# EAGLE design P2PlugTestUSB (EAGLE 9.6.2)
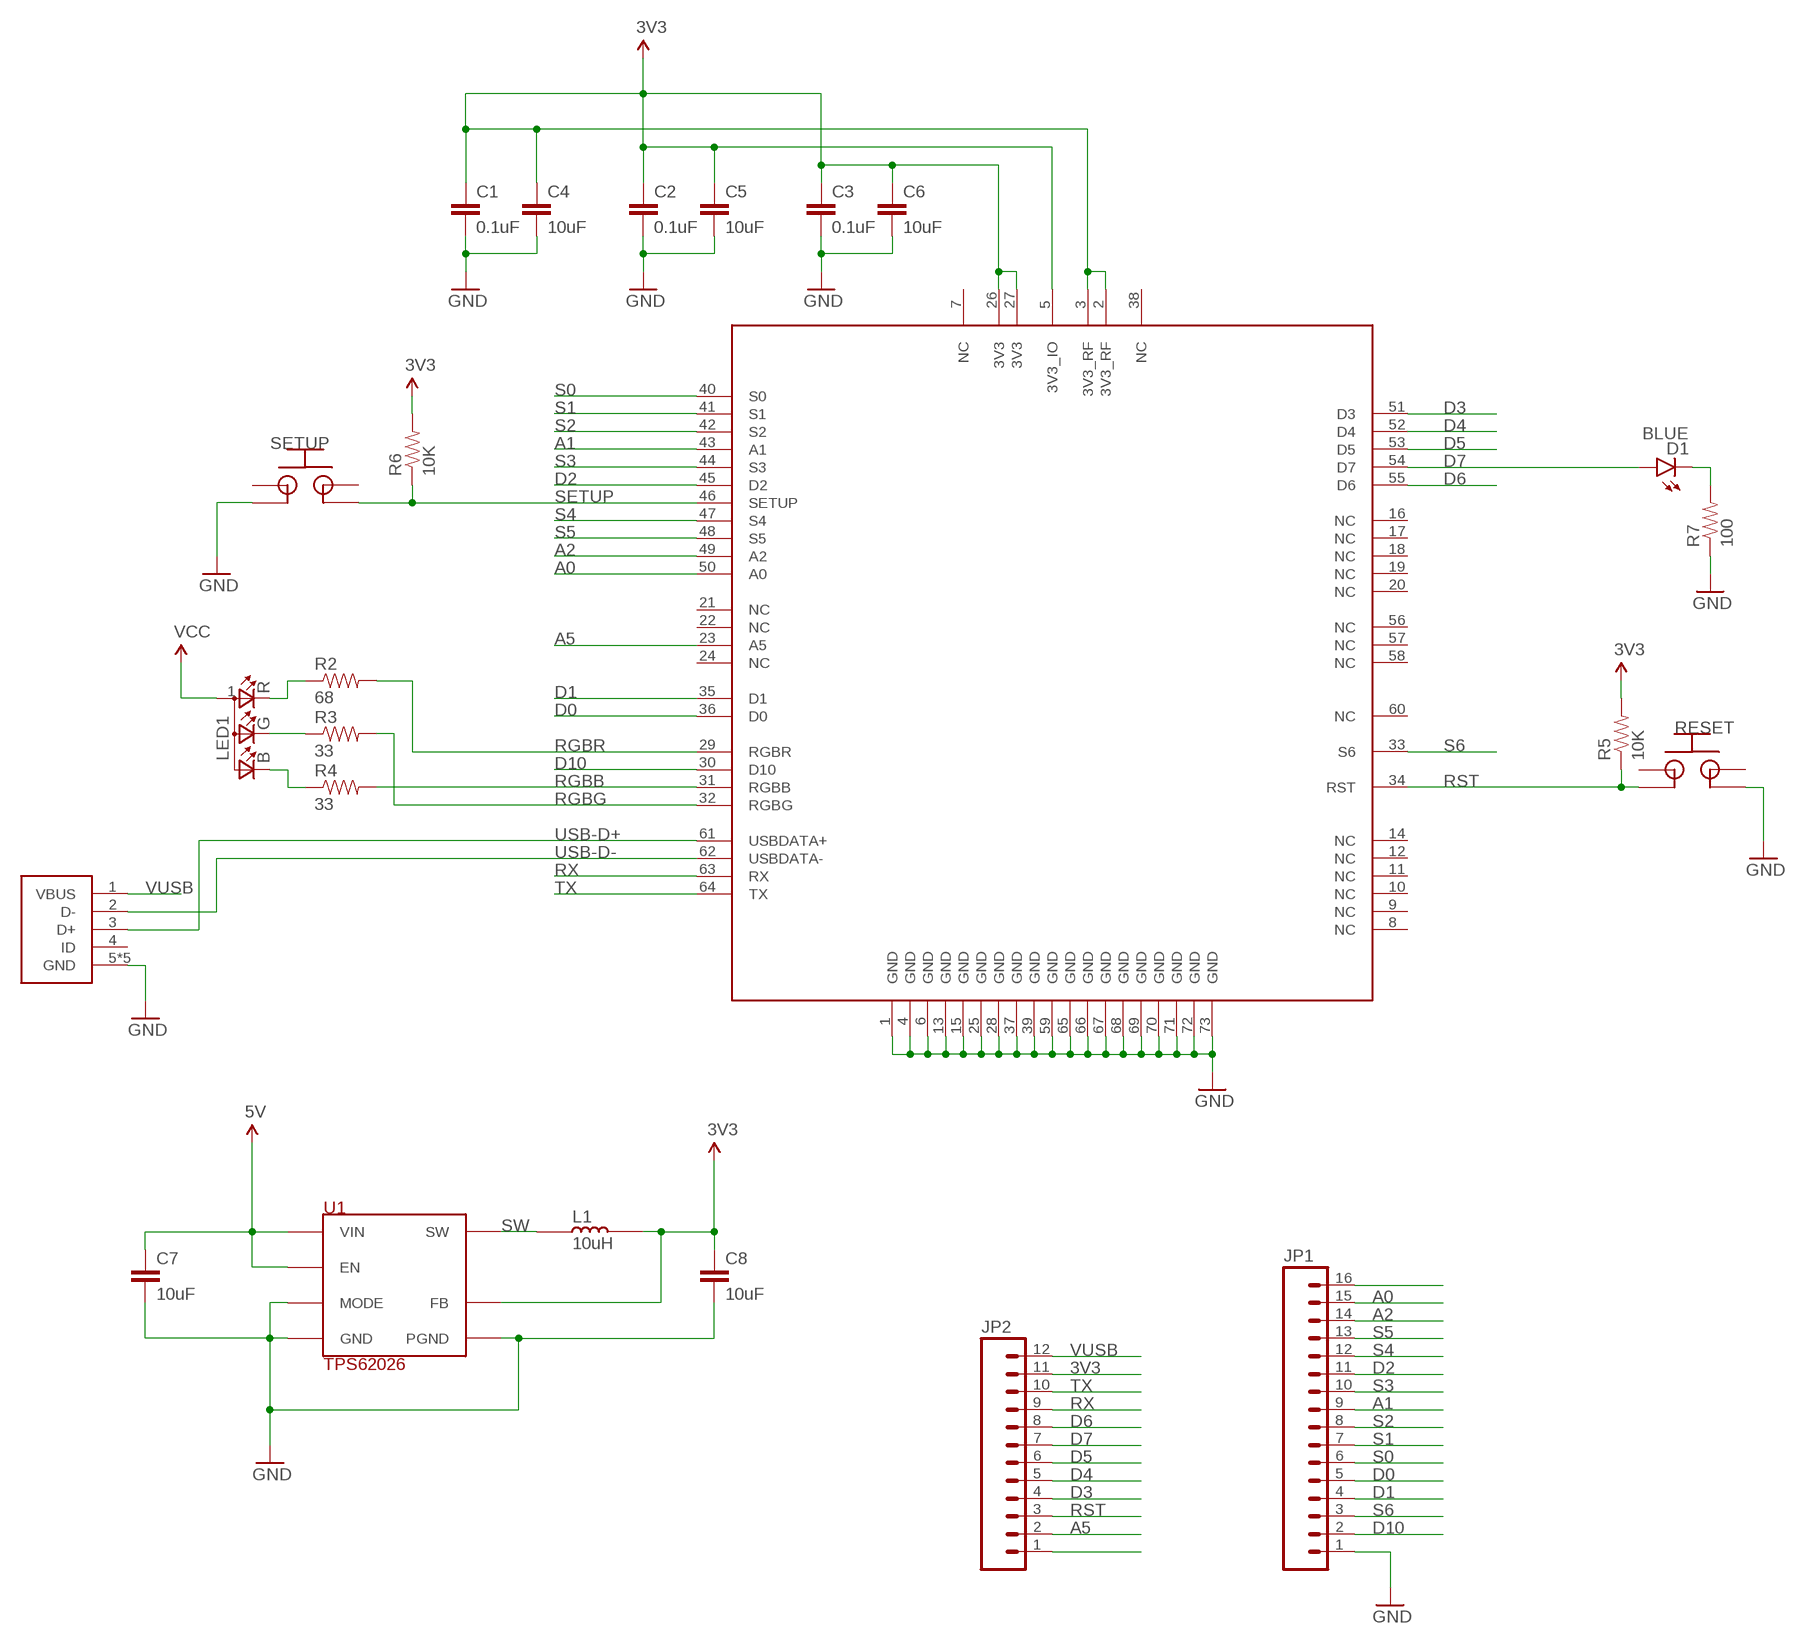
[diagram p0: schematic, sheet 1]

## Parts
C1  0.1uF  CAP-0.1UF-0603  [0603-CAP]
C2  0.1uF  CAP-0.1UF-0603  [0603-CAP]
C3  0.1uF  CAP-0.1UF-0603  [0603-CAP]
C4  10uF  CAP-10UF-0603  [0603-CAP]
C5  10uF  CAP-10UF-0603  [0603-CAP]
C6  10uF  CAP-10UF-0603  [0603-CAP]
C7  10uF  CAP-10UF-0603  [0603-CAP]
C8  10uF  CAP-10UF-0603  [0603-CAP]
D1  BLUE  LED-BLUE0603  [LED-0603]
JP1  M16PTH  [1X16]
JP2  M12PTH  [1X12]
L1  10uH  INDUCTOR-10UH  [BOURNS-INDUCTOR-3X3]
LED1  LED-RGB-CREE-SMD  [LED-RGB-CREE-SMD]
R2  68  RES-68-0603.DEV  [0603-RES]
R3  33  RES-33-0603.DEV  [0603-RES]
R4  33  RES-33-0603.DEV  [0603-RES]
R5  10K  RES-10K-06030603  [0603-RES]
R6  10K  RES-10K-06030603  [0603-RES]
R7  100  RES-100-0603.DEV  [0603-RES]
U1  TPS62026  TPS62026-REG-3.3V  [10-HVSSOP-TI]
U$1  USB-MICRO-B-SOCKET-AMPHENOL  [USB-B-SMT-AMPHENOL]
U$3  P2  [P2]
U$4  SWITCH-PTS645  [SWITCH-PTS645]
U$5  SWITCH-PTS645  [SWITCH-PTS645]

## Nets
3V3: C1.1 C2.1 C3.1 C4.1 C5.1 C6.1 C8.1 JP2.11 L1.2 LED1.1(A) R5.2 R6.2 U1.5(FB) U$3.2(3V3_RF) U$3.3(3V3_RF) U$3.5(3V3_IO) U$3.26(3V3) U$3.27(3V3) ; supply symbol labelled VCC
A0: JP1.15 U$3.50(A0)
A1: JP1.9 U$3.43(A1)
A2: JP1.14 U$3.49(A2)
A5: JP2.2 U$3.23(A5)
D0: JP1.5 U$3.36(D0)
D1: JP1.4 U$3.35(D1)
D2: JP1.11 U$3.45(D2)
D3: JP2.4 U$3.51(D3)
D4: JP2.5 U$3.52(D4)
D5: JP2.6 U$3.53(D5)
D6: JP2.8 U$3.55(D6)
D7: D1.A JP2.7 U$3.54(D7)
D10: JP1.2 U$3.30(D10)
GND: C1.2 C2.2 C3.2 C4.2 C5.2 C6.2 C7.2 C8.2 JP1.1 R7.1 U1.4(GND) U1.6(MODE) U1.9(PGND) U1.10(PGND) U1.P(GND) U$1.5(GND) U$1.P$1(GND) U$1.P$2(GND) U$1.P$6(GND) U$1.P$7(GND) U$3.1(GND) U$3.4(GND) U$3.6(GND) U$3.13(GND) U$3.15(GND) U$3.25(GND) U$3.28(GND) U$3.37(GND) U$3.39(GND) U$3.59(GND) U$3.65(GND) U$3.66(GND) U$3.67(GND) U$3.68(GND) U$3.69(GND) U$3.70(GND) U$3.71(GND) U$3.72(GND) U$3.73(GND) U$4.2 U$5.4
N$1: JP2.1
N$2: JP1.16
N$3: D1.C R7.2
N$5: LED1.4(R) R2.1
N$6: LED1.3(G) R3.1
N$7: LED1.2(B) R4.1
RGBB: R4.2 U$3.31(RGBB)
RGBG: R3.2 U$3.32(RGBG)
RGBR: R2.2 U$3.29(RGBR)
RST: JP2.3 R5.1 U$3.34(RST) U$5.2
RX: JP2.9 U$3.63(RX)
S0: JP1.6 U$3.40(S0)
S1: JP1.7 U$3.41(S1)
S2: JP1.8 U$3.42(S2)
S3: JP1.10 U$3.44(S3)
S4: JP1.12 U$3.47(S4)
S5: JP1.13 U$3.48(S5)
S6: JP1.3 U$3.33(S6)
SETUP: R6.1 U$3.46(SETUP) U$4.4
SW: L1.1 U1.7(SW) U1.8(SW)
TX: JP2.10 U$3.64(TX)
USB-D+: U$1.3(D+) U$3.61(USBDATA+)
USB-D-: U$1.2(D-) U$3.62(USBDATA-)
VUSB: C7.1 JP2.12 U1.1(EN) U1.2(VIN) U1.3(VIN) U$1.1(VBUS) ; supply symbol labelled 5V
Unconnected: U$1.4(ID) U$3.7(NC) U$3.8(NC) U$3.9(NC) U$3.10(NC) U$3.11(NC) U$3.12(NC) U$3.14(NC) U$3.16(NC) U$3.17(NC) U$3.18(NC) U$3.19(NC) U$3.20(NC) U$3.21(NC) U$3.22(NC) U$3.24(NC) U$3.38(NC) U$3.56(NC) U$3.57(NC) U$3.58(NC) U$3.60(NC) U$4.1 U$4.3 U$5.1 U$5.3

## Notes on the sheet
- SETUP
- RESET

## Library data of the parts
C1-C3 = rickk2:CAP-0.1UF-0603: CAP CER 0.1UF 16V X7R 0603 https://www.digikey.com/product-detail/en/murata-electronics-north-america/GRM188R71C104KA01D/490-1532-1-ND/587771
C4-C8 = rickk2:CAP-10UF-0603: CAP CER 10UF 16V X5R 0805 $ 0.21 https://www.digikey.com/product-detail/en/murata-electronics-north-america/GRM21BR61C106KE15L/490-3886-1-ND/965928
D1 = rickk2:LED-BLUE: Lite-On LTST-C193TBKT-5A 0603 clear lens 6.25 mcd 130° viewing 15 mcd 5mA @ 2.8V $0.47 Blue 470nm LED Indication - Discrete 2.8V 0603 (1608 Metric) https://www.digikey.com/product-detail/en/lite-on-inc/LTST-C193TBKT-5A/160-1827-1-ND/2355044 R = 100 ohms @ 3.3V Stripe is on the anode (+) side on the bottom side!
JP1 = rickk2:M16: 1x16 .1" header Sullins Connector Solutions PPTC161LFBN-RC $0.98 16 Position Header Connector Through Hole https://www.digikey.com/product-detail/en/sullins-connector-solutions/PPTC161LFBN-RC/S7014-ND/810154
JP2 = rickk2:M12: Sullins Connector Solutions PPTC121LFBN-RC $0.76 12 Position Header Connector Through Hole https://www.digikey.com/product-detail/en/sullins-connector-solutions/PPTC121LFBN-RC/S6100-ND/807231 Header 12 Standard 12-pin 0.1" header. Use with straight break away headers (SKU : PRT-00116), right angle break away headers (PRT-00553), swiss pins (PRT-00743), machine pins (PRT-00117), and female headers (PRT-00115).
L1 = rickk2:INDUCTOR-10UH: Bourns Inc. SRN3015-100M $0.46 FIXED IND 10UH 1A 276 MOHM SMD 10µH Semi-Shielded Wirewound Inductor 1A 276 mOhm Max Nonstandard https://www.digikey.com/product-detail/en/bourns-inc/SRN3015-100M/SRN3015-100MCT-ND/2756149
LED1 = rickk2:LED-RGB-CREE-SMD: LED RGB DIFFUSED 4SMD $ 0.35 Cree CLMVB-FKA-CFHEHLCBB7A363 2mm 4-PLCC common anode RGB LED https://www.digikey.com/product-detail/en/cree-inc/CLMVB-FKA-CFHEHLCBB7A363/CLMVB-FKA-CFHEHLCBB7A363CT-ND/6138627 Red=68 ohm, Green/Blue=33 ohm @ 3.3V
R2 = rickk2:RES-68-0603.DEV: https://www.digikey.com/product-detail/en/panasonic-electronic-components/ERJ-3EKF68R0V/P68.0HCT-ND/1746805 Panasonic SMD 0603 1% 1/10W
R3 R4 = rickk2:RES-33-0603.DEV: https://www.digikey.com/product-detail/en/panasonic-electronic-components/ERJ-3EKF33R0V/P33.0HCT-ND/1746765 Panasonic SMD 0603 1% 1/10W
R5 R6 = rickk2:RES-10K-0603: RES SMD 10K OHM 5% 1/4W 0603 $ 0.10 https://www.digikey.com/product-detail/en/panasonic-electronic-components/ERJ-PA3J103V/P10KBZCT-ND/5036237
R7 = rickk2:RES-100-0603.DEV: RES SMD 100 OHM 5% 1/10W 0603 $ 0.10 ±5% 0.1W, 1/10W Chip Resistor 0603 (1608 Metric) Automotive AEC-Q200 Thick Film https://www.digikey.com/product-detail/en/panasonic-electronic-components/ERJ-3GEYJ101V/P100GCT-ND/134714
U1 = rickk2:TPS62026-REG-3.3V: Texas Instruments TPS62026DGQR $2.36 IC REG BUCK 3.3V 600MA 10MSOP Buck Switching Regulator IC Positive Fixed 3.3V 1 Output 600mA 10-PowerTFSOP, 10-MSOP (0.118", 3.00mm Width) https://www.digikey.com/en/products/detail/texas-instruments/TPS62026DGQ/1672251 3.6V to 6V input 10uH inductor, 10 uF input and output caps
U$1 = rickk2:USB-MICRO-B-SOCKET-AMPHENOL: CONN USB MICRO B RECPT SMT R/A $0.42 Amphenol FCI 10118194-0001LF https://www.digikey.com/products/en?keywords=609-4618-1-nd Updated 2022-03-28 w/PTH on large hole, add holes and pads to GND
U$3 = rickk2:P2: Particle P2 module (WiFi with antenna)
U$4 U$5 = rickk2:SWITCH-PTS645: SWITCH TACTILE SPST-NO 0.05A 12V $ 0.21 C&K PTS645SH50SMTR92 LFS Gray button, tactile, surface mount, 6mm x 6mm, 0.05A @ 12VDC, gull wing, top actuated https://www.digikey.com/product-detail/en/c-k/PTS645SH50SMTR92-LFS/CKN9085CT-ND/1146817

## Board
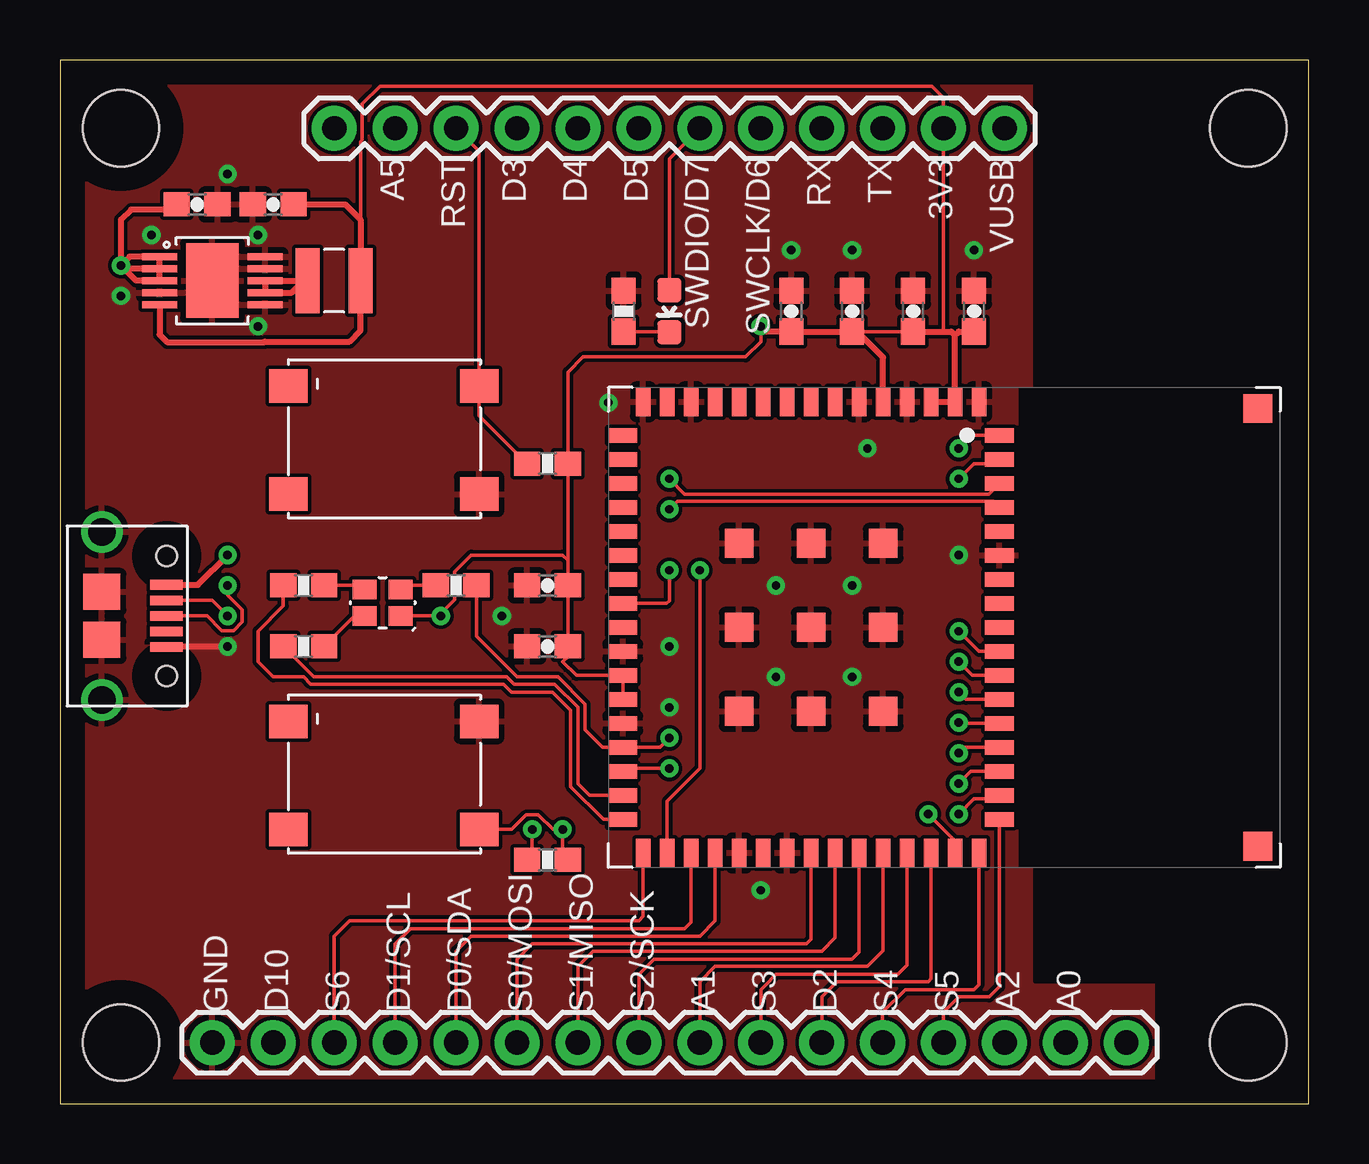
[diagram p1: board, top side]
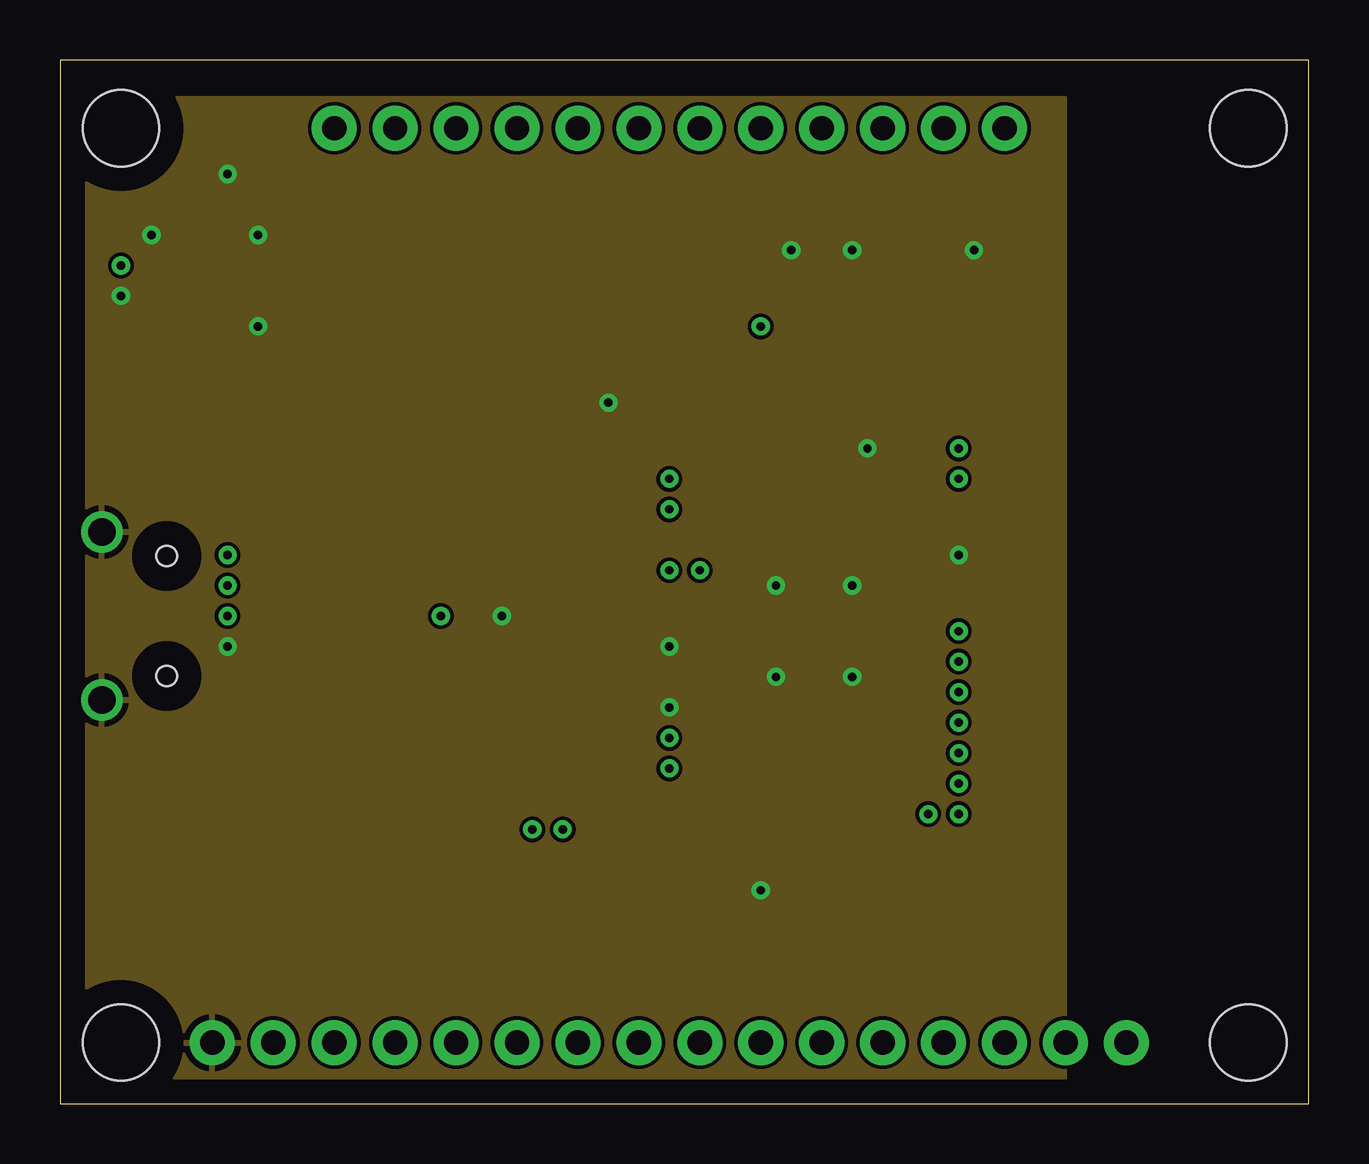
[diagram p2: board, inner layer GND]
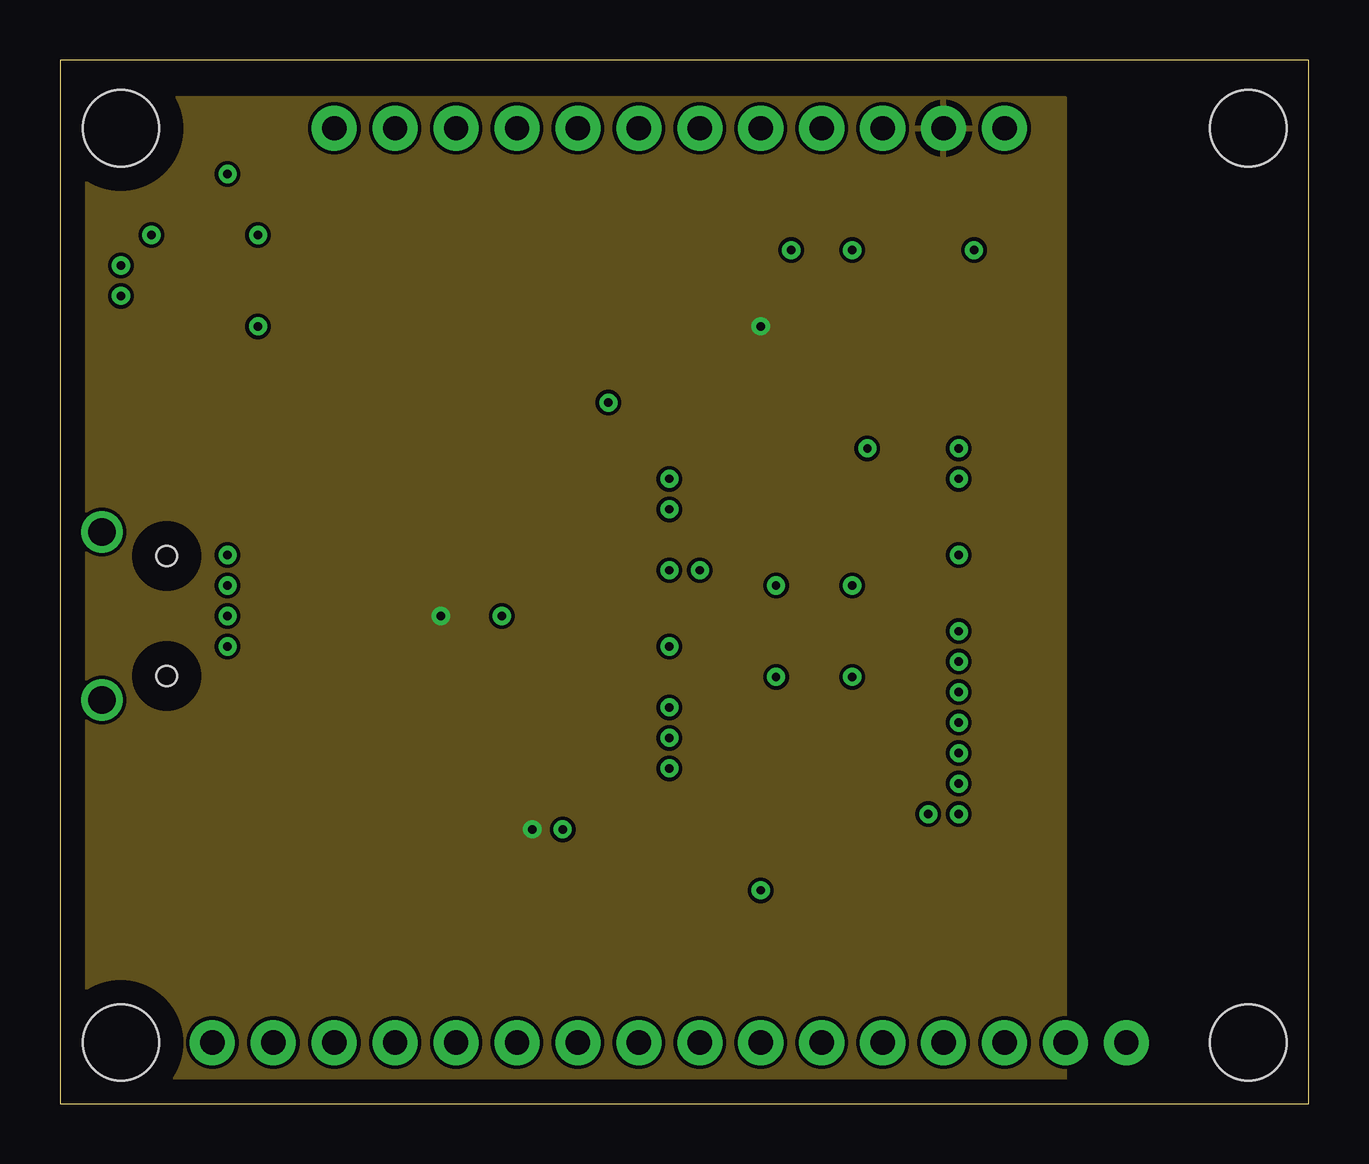
[diagram p3: board, inner layer VCC]
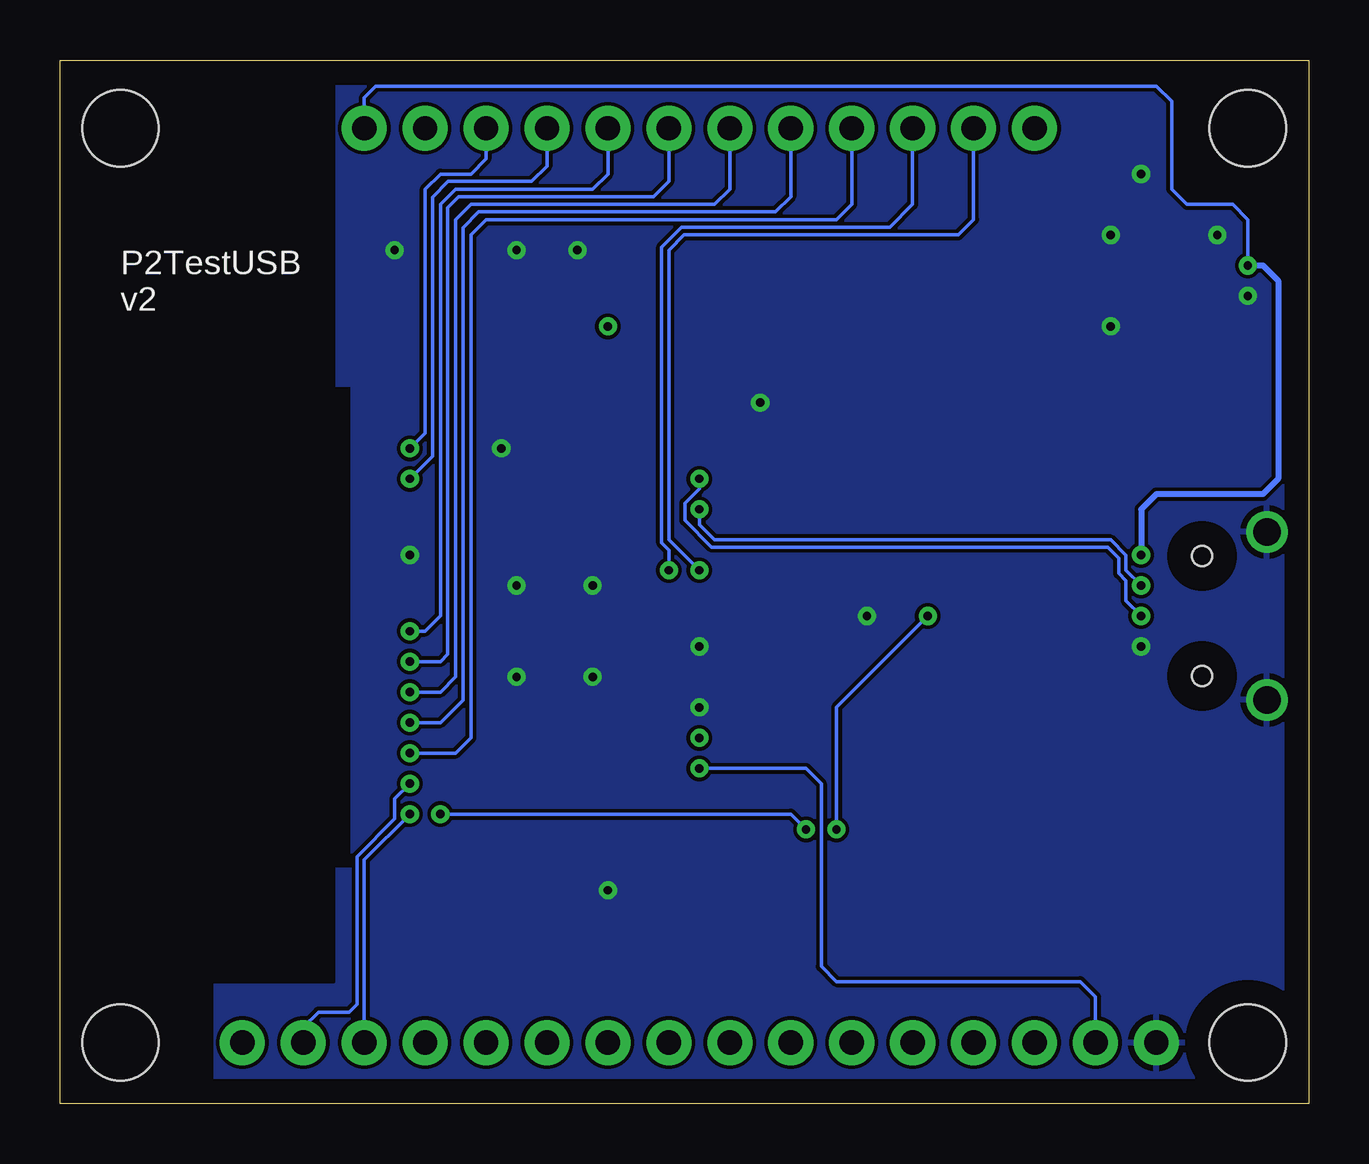
[diagram p4: board, bottom side, seen from below]

Size 52.05 x 43.48 mm. Coordinates in mm from the lower left corner, seen from the top.
Outline: 0,0 52.05,0 52.05,43.48 0,43.48 0,0
Copper layers (1*16): Top 0.035mm / dielectric 1.5mm / Bottom 0.035mm
Design rules "default *": minimum track width 6mil, minimum drill 0.35mm, track to track 6mil, track to pad 6mil, pad to pad 6mil, via to via 6mil, smd to smd 6mil, copper to edge 40mil, drill to drill 6mil, minimum pad ring 10mil, minimum via ring 8mil, stop-mask expansion 4mil, vias tented up to drill 0mil, thermal gap 10mil
Holes 3.17 mm at 49.53,40.64 49.53,2.54 2.54,2.54 2.54,40.64
tRestrict: area 40.6,0 to 55.9,44.5
bRestrict: area 40.6,0 to 55.9,44.5

### Footprints (pad centres in the part's own frame; a part is rotated, then mirrored left to right if it is on the bottom)
0603-CAP = smd 1.1 x 1: 1 -0.85,0; 2 0.85,0
LED-0603 = smd 1 x 1: A 0,-0.877; C 0,0.877
1X16 = drill 1.016 pad 1.88: 1 0,0; 2 2.54,0; 3 5.08,0; 4 7.62,0; 5 10.16,0; 6 12.7,0; 7 15.24,0; 8 17.78,0; 9 20.32,0; 10 22.86,0; 11 25.4,0; 12 27.94,0; 13 30.48,0; 14 33.02,0; 15 35.56,0; 16 38.1,0
1X12 = drill 1.016 pad 1.88: 1 0,0; 2 2.54,0; 3 5.08,0; 4 7.62,0; 5 10.16,0; 6 12.7,0; 7 15.24,0; 8 17.78,0; 9 20.32,0; 10 22.86,0; 11 25.4,0; 12 27.94,0
BOURNS-INDUCTOR-3X3 = smd 2.7 x 1: 1 0,1.1; 2 0,-1.1
LED-RGB-CREE-SMD = smd 1 x 0.8: 1 1.5,0; 2 0,0; 3 0,1.1; 4 1.5,1.1
0603-RES = smd 1.1 x 1: 1 -0.85,0; 2 0.85,0
10-HVSSOP-TI = smd 0.3 x 1.45: 1 -1,-2.2; 2 -0.5,-2.2; 3 0,-2.2; 4 0.5,-2.2; 5 1,-2.2; 6 1,2.2; 7 0.5,2.2; 8 0,2.2; 9 -0.5,2.2; 10 -1,2.2 | smd 3.1 x 2.2: P 0,0
USB-B-SMT-AMPHENOL = smd 0.4 x 1.35: 1 -1.3,0; 2 -0.65,0; 3 0,0; 4 0.65,0; 5 1.3,0 | drill 1.15: P$1 3.5,-2.7; P$2 -3.5,-2.7 | smd 1.5 x 1.55: P$6 -1,-2.7; P$7 1,-2.7 | hole 0.85: -2.5,0; 2.5,0
P2 = smd 1.2 x 0.6: 1 0.6,15.45; 2 0.6,14.45; 3 0.6,13.45; 4 0.6,12.45; 5 0.6,11.45; 6 0.6,10.45; 7 0.6,9.45; 8 0.6,8.45; 9 0.6,7.45; 10 0.6,6.45; 11 0.6,5.45; 12 0.6,4.45; 13 0.6,3.45; 14 0.6,2.45; 15 0.6,1.45; 33 19.4,1.45; 34 19.4,2.45; 35 19.4,3.45; 36 19.4,4.45; 37 19.4,5.45; 38 19.4,6.45; 39 19.4,7.45; 40 19.4,8.45; 41 19.4,9.45; 42 19.4,10.45; 43 19.4,11.45; 44 19.4,12.45; 45 19.4,13.45; 46 19.4,14.45; 47 19.4,15.45 | smd 0.6 x 1.2: 16 2,0.6; 17 3,0.6; 18 4,0.6; 19 5,0.6; 20 6,0.6; 21 7,0.6; 22 8,0.6; 23 9,0.6; 24 10,0.6; 25 11,0.6; 26 12,0.6; 27 13,0.6; 28 14,0.6; 29 15,0.6; 30 16,0.6; 31 17,0.6; 32 18,0.6; 48 18,16.3; 49 17,16.3; 50 16,16.3; 51 15,16.3; 52 14,16.3; 53 13,16.3; 54 12,16.3; 55 11,16.3; 56 10,16.3; 57 9,16.3; 58 8,16.3; 59 7,16.3; 60 6,16.3; 61 5,16.3; 62 4,16.3; 63 3,16.3; 64 2,16.3 | smd 1.2 x 1.2: 65 6.5,11.45; 66 6.5,8.45; 67 6.5,5.45; 68 10,11.45; 69 10,8.45; 70 10,5.45; 71 13.5,11.45; 72 13.5,8.45; 73 13.5,5.45; 74 19.12,27.07; 75 0.88,27.07
SWITCH-PTS645 = smd 1.6 x 1.4: 1 0,4.5; 2 7.95,4.5; 3 0,0; 4 7.95,0

### Placement (x,y rotation side)
C1  38.1,33.02 90 top
C2  33.02,33.02 90 top
C3  20.32,19.05 180 top
C4  35.56,33.02 90 top
C5  30.48,33.02 90 top
C6  20.32,21.59 180 top
C7  5.71,37.47 0 top
C8  8.89,37.47 180 top
D1  25.4,33.02 180 top
JP1  6.35,2.54 0 top
JP2  11.43,40.64 0 top
L1  11.43,34.29 90 top
LED1  12.7,20.32 0 top
R2  16.51,21.59 0 top
R3  10.16,21.59 180 top
R4  10.16,19.05 180 top
R5  20.32,26.67 0 top
R6  20.32,10.16 180 top
R7  23.5,33.02 270 top
U1  6.35,34.29 270 top
U$1  4.45,20.32 270 top
U$3  22.86,29.84 270 top
U$4  9.53,11.43 0 top
U$5  9.53,25.4 0 top

### Tracks (layer width: path | path; a pad name or v marks a point on that pad's centre or on a via)
3V3  (via drill 0.35)
  Top 0.152: U$3.27 U$3.26 21.52,17.84 20.95,18.41 21.17,18.63 C3.1 C6.1 21.17,22.64 | LED1.1 v15.88,20.32 15.88,20.43 16.44,21 16.44,22.15 17.14,22.86 20.95,22.86 21.17,22.64 | 21.17,22.64 R5.2 21.17,30.48 21.8,31.11 28.57,31.11 29.21,31.75 v29.21,32.38 | 36.83,32.17 JP2.11 36.83,41.91 36.35,42.39 13.34,42.39 12.6,41.66 12.6,40.16 12.53,40.09 12.53,36.83 | C2.1 C4.1 | v19.68,11.43 19.68,10.38 R6.2
  Top 0.254: U$3.3 U$3.2 37.31,32.02 | C1.1 37.47,32.17 37.31,32.02 | C4.1 36.83,32.17 37.16,32.17 37.31,32.02 | U$3.5 34.31,31.09 33.23,32.17 C2.1 C5.1 29.43,32.17 v29.21,32.38 | U1.5 4.15,32.05 4.47,31.73 8.53,31.73 8.55,31.75 12.06,31.75 12.53,32.22 L1.2 12.53,36.83 11.89,37.47 C8.1
  Bottom 0.152: v15.88,20.32 19.68,16.51 v19.68,11.43
  pour VCC: 0,0 0,41.91 41.91,41.91 41.91,0
A0  (via drill 0.35)
  Top 0.152: U$3.50 37.98,13.85 v37.47,13.34
  Bottom 0.152: v37.47,13.34 38.1,12.7 38.1,11.86 39.67,10.29 39.67,4.14 40.01,3.81 41.27,3.81 41.91,3.17 JP1.15
A1
  Top 0.152: U$3.43 34.31,6.37 33.66,5.71 27.3,5.71 26.67,5.08 JP1.9
A2  (via drill 0.35)
  Top 0.152: U$3.49 39.02,12.7 38.1,12.7 v37.47,12.06
  Bottom 0.152: v37.47,12.06 39.37,10.16 JP1.14
A5  (via drill 0.35)
  Top 0.152: U$3.23 25.29,20.84 25.4,20.95 v25.4,22.23
  Bottom 0.152: JP2.2 13.97,36.83 14.61,36.2 26.04,36.2 26.67,35.56 26.67,23.5 v25.4,22.23
D0
  Top 0.152: U$3.36 27.3,7.62 26.67,6.99 17.14,6.99 16.51,6.35 JP1.5
D1
  Top 0.152: U$3.35 26.31,7.57 26.04,7.29 14.61,7.29 13.97,6.66 JP1.4
D2
  Top 0.152: U$3.45 36.31,5.2 36.2,5.08 32.38,5.08 31.75,4.45 JP1.11
D3  (via drill 0.35)
  Top 0.152: v37.47,14.61 37.7,14.85 U$3.51
  Bottom 0.152: v37.47,14.61 35.56,14.61 34.92,15.24 34.92,36.2 34.29,36.83 19.68,36.83 19.05,37.47 JP2.4
D4  (via drill 0.35)
  Top 0.152: U$3.52 37.49,15.85 v37.47,15.88
  Bottom 0.152: v37.47,15.88 36.2,15.88 35.26,16.82 35.26,36.5 34.59,37.16 22.23,37.16 21.59,37.8 JP2.5
D5  (via drill 0.35)
  Top 0.152: U$3.53 37.77,16.84 v37.47,17.14
  Bottom 0.152: v37.47,17.14 36.2,17.14 35.56,17.78 35.56,36.83 34.92,37.47 24.77,37.47 24.13,38.1 JP2.6
D6  (via drill 0.35)
  Top 0.152: U$3.55 38.3,18.84 v37.47,19.68
  Bottom 0.152: v37.47,19.68 36.83,19.68 36.2,20.32 36.2,37.47 35.56,38.1 29.84,38.1 29.21,38.73 JP2.8
D7  (via drill 0.35)
  Top 0.152: U$3.54 38.03,17.84 v37.47,18.41 | D1.A 25.4,39.37 JP2.7
  Bottom 0.152: v37.47,18.41 36.2,18.41 35.89,18.72 35.89,37.34 35.43,37.8 27.3,37.8 26.67,38.43 JP2.7
D10  (via drill 0.35)
  Top 0.152: U$3.30 23.59,13.97 v25.4,13.97
  Bottom 0.152: v25.4,13.97 20.95,13.97 20.32,13.34 20.32,5.71 19.68,5.08 9.53,5.08 8.89,4.45 JP1.2
GND  (via drill 0.35)
  Top 0.254: U$1.5 4.47,19.05 v6.99,19.05
  other vias: 37.47,22.86 25.4,19.05 25.4,16.51 22.86,29.21 29.21,8.89 29.84,21.59 33.02,21.59 33.02,17.78 29.84,17.78 18.41,20.32 2.54,33.66 8.26,32.38 8.26,36.2 3.81,36.2 6.99,38.73 33.66,27.3 30.48,35.56 33.02,35.56 38.1,35.56
  pour Top: 0,0 0,44.45 53.34,44.45 53.34,0
  pour GND: 0,0 0,41.91 41.91,41.91 41.91,0
  pour Bottom: 0,0 0,43.18 54.61,43.18 54.61,0
N$3
  Top 0.152: R7.2 25.37,32.17 D1.C
N$5
  Top 0.152: LED1.4 14.37,21.59 R2.1
N$6
  Top 0.152: R3.1 12.53,21.59 LED1.3
N$7
  Top 0.152: R4.1 12.28,20.32 LED1.2
RGBB
  Top 0.152: R4.2 10.58,17.78 18.62,17.78 18.92,17.48 20.62,17.48 21.59,16.51 21.59,13.34 22.08,12.85 U$3.31
RGBG
  Top 0.152: R3.2 9.31,20.74 8.26,19.68 8.26,18.41 8.89,17.78 10.15,17.78 10.45,17.48 18.49,17.48 18.82,17.14 20.52,17.14 21.29,16.38 21.29,13.21 22.65,11.85 U$3.32
RGBR  (via drill 0.35)
  Top 0.152: v25.4,15.24 25,14.85 23.5,14.85 U$3.29 22.62,14.85 21.89,15.57 21.89,16.64 20.75,17.78 19.05,17.78 17.36,19.47 R2.2
RST  (via drill 0.35)
  Top 0.152: R5.1 17.48,28.66 U$5.2 17.48,39.67 JP2.3 | v26.67,22.23 26.67,13.97 25.31,12.61 U$3.34
  Bottom 0.152: JP2.3 16.51,37.47 17.45,36.52 26.14,36.52 26.98,35.69 26.98,23.37 26.67,23.06 v26.67,22.23
RX  (via drill 0.35)
  Top 0.152: U$3.63 38.98,26.67 38.1,26.67 v37.47,26.04
  Bottom 0.152: v37.47,26.04 36.52,26.98 36.52,37.77 35.87,38.43 32.38,38.43 31.75,39.06 JP2.9
S0
  Top 0.152: U$3.40 31.31,6.85 31.11,6.66 19.68,6.66 19.05,6.02 JP1.6
S1
  Top 0.152: U$3.41 32.31,6.91 31.75,6.35 22.23,6.35 21.59,5.71 JP1.7
S2
  Top 0.152: U$3.42 33.31,6.31 33.02,6.02 24.77,6.02 24.13,5.38 JP1.8
S3
  Top 0.152: U$3.44 35.31,5.77 34.92,5.38 29.84,5.38 29.38,4.92 29.21,4.75 JP1.10
S4
  Top 0.152: U$3.47 38.31,4.96 38.1,4.75 35.23,4.75 34.29,3.81 JP1.12
S5
  Top 0.152: U$3.48 39.16,4.87 38.73,4.45 37.47,4.45 36.83,3.81 JP1.13
S6
  Top 0.152: U$3.33 24.31,7.8 24.13,7.62 12.06,7.62 11.43,6.99 JP1.3
SETUP  (via drill 0.35)
  Top 0.152: v36.2,12.06 37.31,10.95 U$3.46 | R6.1 20.95,10.38 v20.95,11.43 20.54,11.43 19.94,12.04 19.43,12.04 18.83,11.43 U$4.4
  Bottom 0.152: v36.2,12.06 21.59,12.06 v20.95,11.43
SW
  Top 0.254: 10.16,34.29 U1.8 U1.7 9.66,33.79 10.16,34.29 | 10.16,34.29 L1.1
TX  (via drill 0.35)
  Top 0.152: U$3.64 38.01,27.84 v37.47,27.3
  Bottom 0.152: v37.47,27.3 36.83,27.94 36.83,38.1 36.2,38.73 34.92,38.73 34.29,39.37 JP2.10
USB-D+  (via drill 0.35)
  Top 0.152: v25.4,24.77 25.73,25.09 38.91,25.09 U$3.61 | v6.99,21.59 6.99,21.18 7.59,20.57 7.59,20.07 7.24,19.71 6.73,19.71 6.13,20.32 U$1.3
  Bottom 0.152: v25.4,24.77 25.4,24.13 24.77,23.5 8.26,23.5 7.62,22.86 7.62,22.23 v6.99,21.59
USB-D-  (via drill 0.35)
  Top 0.152: v25.4,26.04 26.04,25.4 38.72,25.4 U$3.62 | v6.99,20.32 6.33,20.97 U$1.2
  Bottom 0.152: v25.4,26.04 25.4,25.62 26.01,25.02 26.01,24.31 24.89,23.19 8.38,23.19 7.92,22.73 7.92,22.1 7.62,21.79 7.62,20.95 v6.99,20.32
VUSB  (via drill 0.35)
  Top 0.254: v2.54,34.92 2.54,36.83 2.96,37.25 4.65,37.25 C7.1 | U1.2 U1.3 3.17,34.29 v2.54,34.92 | U1.2 U1.1 2.9,35.29 v2.54,34.92 | U1.2 2.67,34.79 v2.54,34.92 | U$1.1 5.75,21.62 v6.99,22.86
  Bottom 0.152: JP2.12 39.37,41.91 38.89,42.39 6.35,42.39 5.71,41.76 5.71,38.1 5.08,37.47 3.17,37.47 2.54,36.83 v2.54,34.92
  Bottom 0.254: v2.54,34.92 1.91,34.92 1.27,34.29 1.27,26.04 1.91,25.4 6.35,25.4 6.99,24.77 v6.99,22.86

### Text on the board
tPlace: A5 | RST | D3 | D4 | D5 | SWDIO/D7 | SWCLK/D6 | RX | TX | 3V3 | VUSB | GND | D10 | S6 | D1/SCL | D0/SDA | S0/MOSI | S1/MISO | S2/SCK | A1 | S3 | D2 | S4 | S5 | A2 | A0
bPlace: P2TestUSB / v2
tDocu: 10uH | BLUE